# Altium project HT32.PrjPcb
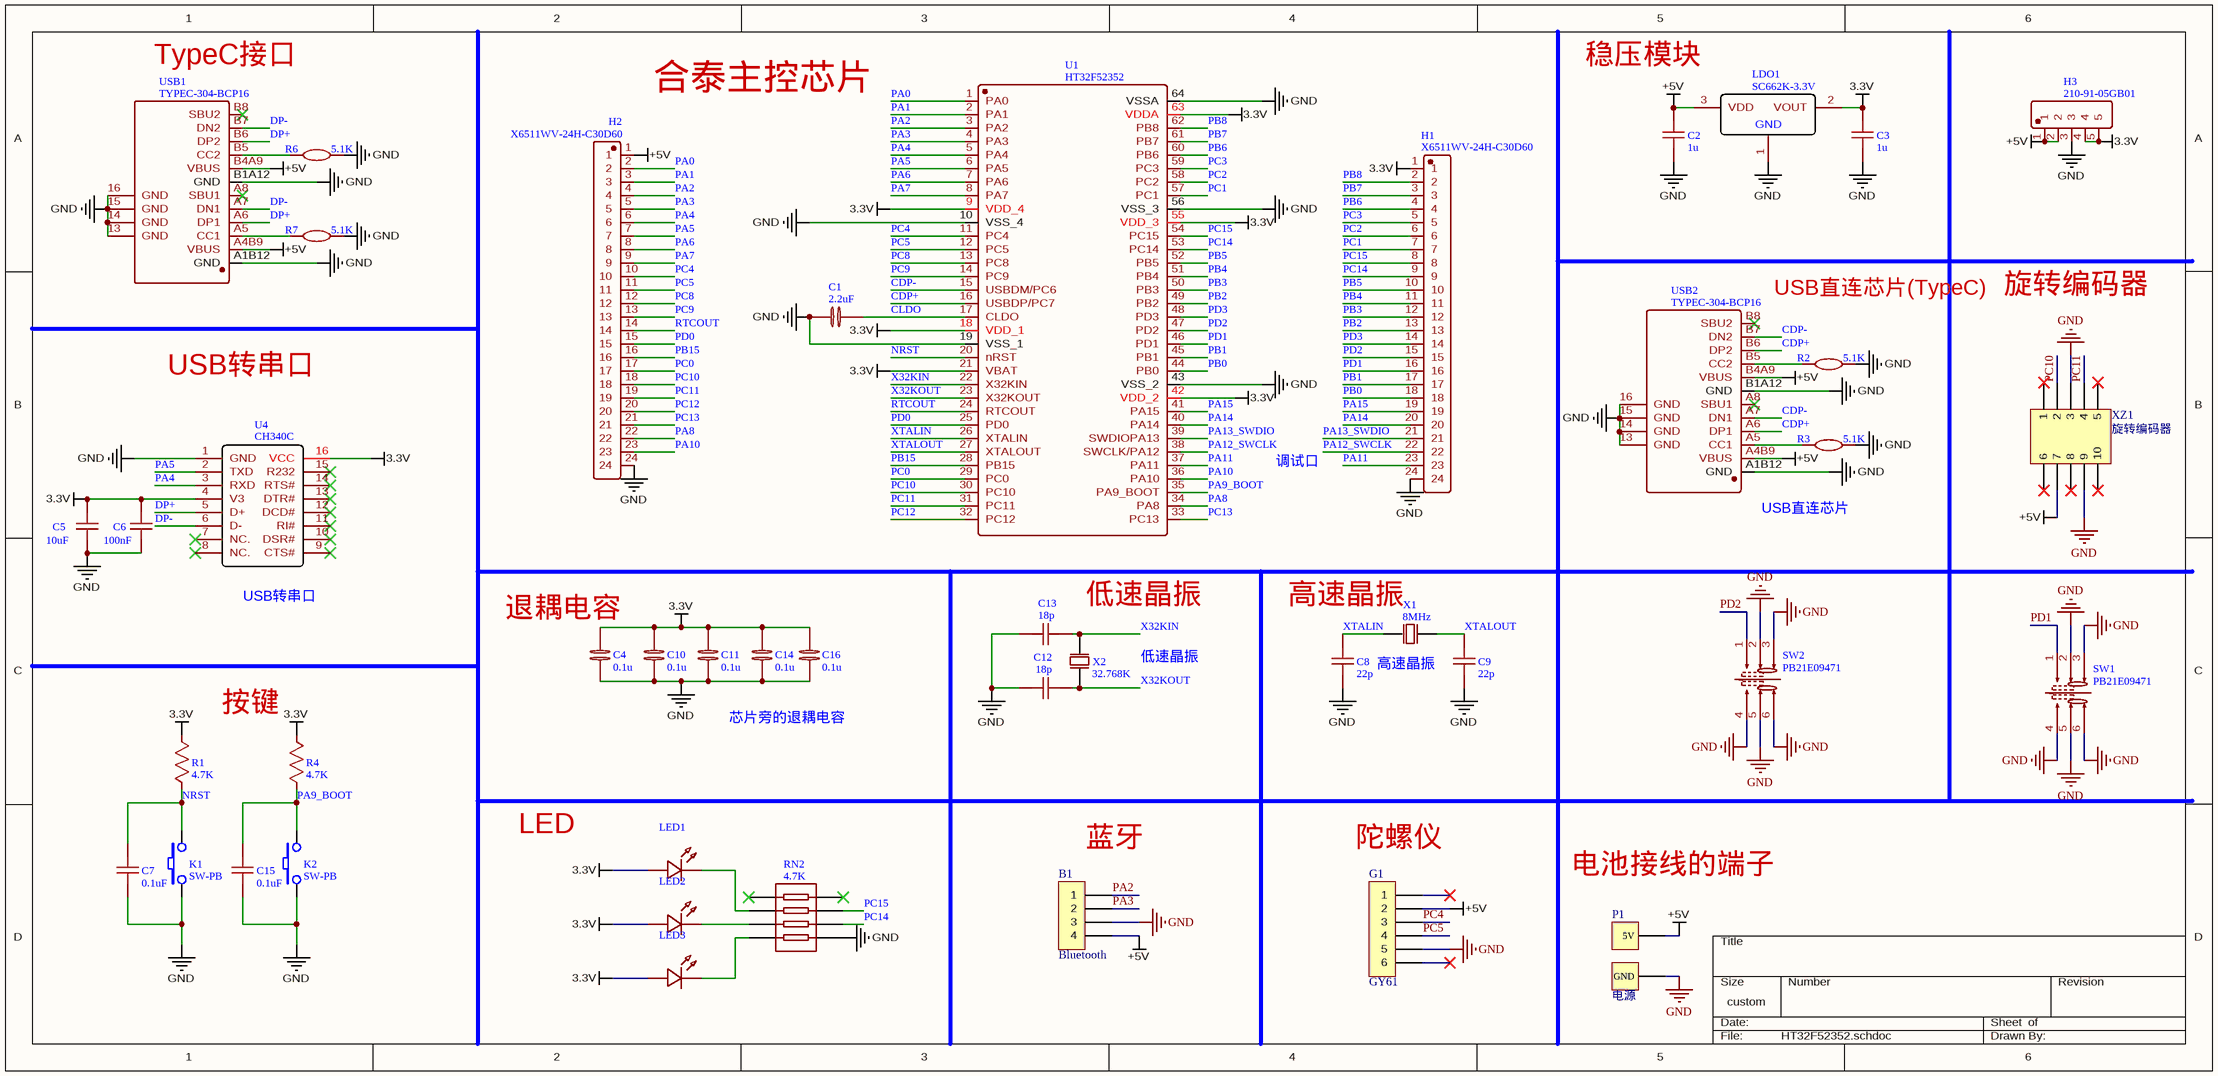
[diagram p0: HT32F52352.schdoc]
1 sheet, 44 parts. Net scope: global (net labels, ports and power ports of the same name join across sheets).
Board file: HT32.PcbDoc

## Sheet HT32F52352.schdoc
size 415 x 200 mm

### Parts
B1  Bluetooth  [HDR1X4]
C1  2.2uF  [0805_C]
C2  1u  [0805_C]
C3  1u  [0805_C]
C4  0.1u  [0805_C]
C5  10uF  [0805_C]
C6  100nF  [0805_C]
C7  0.1uF  [0805_C]
C8  22p  [0805_C]
C9  22p  [0805_C]
C10  0.1u  [0805_C]
C11  0.1u  [0805_C]
C12  18p  [0805_C]
C13  18p  [0805_C]
C14  0.1u  [0805_C]
C15  0.1uF  [0805_C]
C16  0.1u  [0805_C]
G1  GY61  [HDR1X6]
H1  X6511WV-24H-C30D60  [HDR-TH_24P-P2.54-V-M]
H2  X6511WV-24H-C30D60  [HDR-TH_24P-P2.54-V-M]
H3  210-91-05GB01  [HDR-TH_5P-P2.54-V-M]
K1  SW-PB  [SW-SMD_L6.1-W3.7-LS7.9]
K2  SW-PB  [SW-SMD_L6.1-W3.7-LS7.9]
LDO1  SC662K-3.3V  [SOT-23-3_L2.9-W1.3-P1.90-LS2.4-BR]
LED1  LED-0603_B  [LED0603_BLUE]  (value not drawn)
LED2  LED-0603_B  [LED0603_BLUE]  (value not drawn)
LED3  LED-0603_B  [LED0603_BLUE]  (value not drawn)
P1  电源  [PCBComponent_1 - duplicate]
R1  4.7K  [0805_R]
R2  5.1K  [0805_R]
R3  5.1K  [0805_R]
R4  4.7K  [0805_R]
R6  5.1K  [0805_R]
R7  5.1K  [0805_R]
RN2  4.7K  [RES-ARRAY-SMD_0603-8P-L3.2-W1.6-BL]
SW1  PB21E09471  [SW-TH_6P-L8.5-W8.5-P2.50-LS5.5-BL]
SW2  PB21E09471  [SW-TH_6P-L8.5-W8.5-P2.50-LS5.5-BL]
U1  HT32F52352  [LQFP-64_L7.0-W7.0-P0.40-LS9.2-BL]
U4  CH340C  [SOP-16_L10.0-W3.9-P1.27-LS6.0-BL]
USB1  TYPEC-304-BCP16  [USB-C-SMD_TYPEC-304-BCP16]
USB2  TYPEC-304-BCP16  [USB-C-SMD_TYPEC-304-BCP16]
X1  8MHz  [HC-49S_L11.4-W4.8]
X2  32.768K  [OSC-TH_BD3.1-P0.8-D0.3]
XZ1  旋转编码器  [rotary encoder]

### Nets
3.3V: C3.2 C4.2 C5.2 C6.1 C10.2 C11.2 C14.2 C16.2 H1.1 H3.4 H3.5 LDO1.2(VOUT) LED1.1 LED2.1 LED3.1 R1.2 R4.2 U1.9(VDD_4) U1.18(VDD_1) U1.21(VBAT) U1.42(VDD_2) U1.55(VDD_3) U1.63(VDDA) U4.4(V3) U4.16(VCC)
+5V: B1.4 C2.2 G1.2 H2.1 H3.1 H3.2 LDO1.3(VDD) P1.1(5V) USB1.A4B9(VBUS) USB1.B4A9(VBUS) USB2.A4B9(VBUS) USB2.B4A9(VBUS) XZ1.7
GND: B1.3 C1.1 C2.1 C3.1 C4.1 C5.1 C6.2 C7.1 C8.1 C9.1 C10.1 C11.1 C12.2 C13.1 C14.1 C15.1 C16.1 G1.5 H1.24 H2.24 H3.3 K1.2 K2.2 LDO1.1(GND) P1.2(GND) R2.1 R3.1 R6.1 R7.1 RN2.5 SW1.2 SW1.3 SW1.4 SW1.5 SW1.6 SW2.2 SW2.3 SW2.4 SW2.5 SW2.6 U1.10(VSS_4) U1.19(VSS_1) U1.43(VSS_2) U1.56(VSS_3) U1.64(VSSA) U4.1(GND) USB1.13(GND) USB1.14(GND) USB1.15(GND) USB1.16(GND) USB1.A1B12(GND) USB1.B1A12(GND) USB2.13(GND) USB2.14(GND) USB2.15(GND) USB2.16(GND) USB2.A1B12(GND) USB2.B1A12(GND) XZ1.3 XZ1.9
CDP+: U1.16(USBDP/PC7) USB2.A6(DP1) USB2.B6(DP2)
CDP-: U1.15(USBDM/PC6) USB2.A7(DN1) USB2.B7(DN2)
CLDO: C1.2 U1.17(CLDO)
DP+: U4.5(D+) USB1.A6(DP1) USB1.B6(DP2)
DP-: U4.6(D-) USB1.A7(DN1) USB1.B7(DN2)
NRST: C7.2 K1.1 R1.1 U1.20(nRST)
PA0: H2.2 U1.1(PA0)
PA1: H2.3 U1.2(PA1)
PA2: B1.1 H2.4 U1.3(PA2)
PA3: B1.2 H2.5 U1.4(PA3)
PA4: H2.6 U1.5(PA4) U4.3(RXD)
PA5: H2.7 U1.6(PA5) U4.2(TXD)
PA6: H2.8 U1.7(PA6)
PA7: H2.9 U1.8(PA7)
PA8: H2.22 U1.34(PA8)
PA9_BOOT: C15.2 K2.1 R4.1 U1.35(PA9_BOOT)
PA10: H2.23 U1.36(PA10)
PA11: H1.23 U1.37(PA11)
PA12_SWCLK: H1.22 U1.38(SWCLK/PA12)
PA13_SWDIO: H1.21 U1.39(SWDIOPA13)
PA14: H1.20 U1.40(PA14)
PA15: H1.19 U1.41(PA15)
PB0: H1.18 U1.44(PB0)
PB1: H1.17 U1.45(PB1)
PB2: H1.13 U1.49(PB2)
PB3: H1.12 U1.50(PB3)
PB4: H1.11 U1.51(PB4)
PB5: H1.10 U1.52(PB5)
PB6: H1.4 U1.60(PB6)
PB7: H1.3 U1.61(PB7)
PB8: H1.2 U1.62(PB8)
PB15: H2.16 U1.28(PB15)
PC0: H2.17 U1.29(PC0)
PC1: H1.7 U1.57(PC1)
PC2: H1.6 U1.58(PC2)
PC3: H1.5 U1.59(PC3)
PC4: G1.3 H2.10 U1.11(PC4)
PC5: G1.4 H2.11 U1.12(PC5)
PC8: H2.12 U1.13(PC8)
PC9: H2.13 U1.14(PC9)
PC10: H2.18 U1.30(PC10) XZ1.2
PC11: H2.19 U1.31(PC11) XZ1.4
PC12: H2.20 U1.32(PC12)
PC13: H2.21 U1.33(PC13)
PC14: H1.9 RN2.6 U1.53(PC14)
PC15: H1.8 RN2.7 U1.54(PC15)
PD0: H2.15 U1.25(PD0)
PD1: H1.16 SW1.1 U1.46(PD1)
PD2: H1.15 SW2.1 U1.47(PD2)
PD3: H1.14 U1.48(PD3)
RTCOUT: H2.14 U1.24(RTCOUT)
X32KIN: C13.2 U1.22(X32KIN) X2.1(OSC1)
X32KOUT: C12.1 U1.23(X32KOUT) X2.2(OSC2)
XTALIN: C8.2 U1.26(XTALIN) X1.1(OSC1)
XTALOUT: C9.2 U1.27(XTALOUT) X1.2(OSC2)
NetLED1_2: LED1.2 RN2.2
NetLED2_2: LED2.2 RN2.3
NetLED3_2: LED3.2 RN2.4
NetR2_2: R2.2 USB2.B5(CC2)
NetR3_2: R3.2 USB2.A5(CC1)
NetR6_2: R6.2 USB1.B5(CC2)
NetR7_2: R7.2 USB1.A5(CC1)

Not connected (* = marked no-connect by the designer): G1 1* 6*; RN2 1* 8*; U4 7(NC.)* 8(NC.)* 9(CTS#)* 10(DSR#)* 11(RI#)* 12(DCD#)* 13(DTR#)* 14(RTS#)* 15(R232)*; USB1 A8(SBU1)* B8(SBU2)*; USB2 A8(SBU1)* B8(SBU2)*; XZ1 1* 5* 6* 8* 10*

### Notes on the sheet
- (near USB1) TypeC接口
- 稳压模块
- 合泰主控芯片
- USB直连芯片(TypeC)
- 旋转编码器
- USB转串口
- 调试口
- USB直连芯片
- (near U4) USB转串口
- (near C4) 退耦电容
- 低速晶振
- 高速晶振
- 按键
- 芯片旁的退耦电容
- LED
- (near B1) 蓝牙
- (near G1) 陀螺仪
- 电池接线的端子

### Library data of the parts
C1 = 2.2uF: nameAlias: Value(F); Contributor: LCEDA_Lib; spicePre: C; spiceSymbolName: C_0603_EU
C2 C3 = 1u: nameAlias: Value(F); Contributor: LCEDA_Lib; spicePre: C; spiceSymbolName: C_0603_US
C4 C10 C11 C14 C16 = 0.1u: nameAlias: Value(F); Contributor: LCEDA_Lib; spicePre: C; spiceSymbolName: C_0603_EU
C5 = 10uF: nameAlias: Value(F); spicePre: C; spiceSymbolName: Cap_RAD-0.1_US
C6 = 100nF: nameAlias: Value(F); spicePre: C; spiceSymbolName: Cap_RAD-0.1_US
C7 C15 = 0.1uF: nameAlias: Value(F); spicePre: C; spiceSymbolName: Cap_RAD-0.1_US
C8 C9 = 22p: nameAlias: Value(F); Contributor: LCEDA_Lib; spicePre: C; spiceSymbolName: C_0603_US
C12 C13 = 18p: nameAlias: Value(F); Contributor: LCEDA_Lib; spicePre: C; spiceSymbolName: C_0603_US
H1 H2 = X6511WV-24H-C30D60: BOM_Manufacturer: XKB Connectivity; Contributor: LCSC; BOM_Supplier: LCSC; BOM_Supplier Part: C725956; BOM_Manufacturer Part: X6511WV-24H-C30D60; BOM_JLCPCB Part Class: Extended Part; spicePre: H; spiceSymbolName: X6511WV-24H-C30D60
H3 = 210-91-05GB01: BOM_Manufacturer: PINREX; Contributor: LCSC; BOM_Supplier: LCSC; BOM_Supplier Part: C390682; BOM_Manufacturer Part: 210-91-05GB01; BOM_JLCPCB Part Class: Extended Part; spicePre: H; spiceSymbolName: 210-91-05GB01
K1 K2 = SW-PB: Contributor: ZhangYonghui; spicePre: K; spiceSymbolName: SW-PB
LDO1 = SC662K-3.3V: BOM_Manufacturer: FM; BOM_Supplier: LCSC; BOM_Manufacturer Part: SC662K-3.3V; BOM_Supplier Part: C83932; BOM_JLCPCB Part Class: Extended Part; spicePre: L; spiceSymbolName: SC662K-3.3V
LED1-LED3 = LED-0603_B: BOM_Manufacturer: EVERLIGHT(台湾亿光); BOM_Manufacturer Part: 19-217/BHC-ZL1M2RY/3T; Contributor: LCEDA_01; BOM_Supplier Part: C72041; BOM_Supplier: LCSC; spicePre: L; spiceSymbolName: LED-0603_B
R1 R4 = 4.7K: nameAlias: Value(Ω); Contributor: LCEDA_Lib; spicePre: R; spiceSymbolName: R_0603_US
R2 R3 R6 R7 = 5.1K: nameAlias: Value(Ω); spicePre: R; spiceSymbolName: Resistor; BOM_Supplier: LCSC
RN2 = 4.7K: BOM_Manufacturer: PANASONIC; BOM_Manufacturer Part: EXB-38V472JV; nameAlias: Resistance (Ohms); Contributor: LCSC; BOM_Supplier: LCSC; BOM_Supplier Part: C194232; BOM_JLCPCB Part Class: Extended Part; spicePre: R; spiceSymbolName: EXB-38V472JV
SW1 SW2 = PB21E09471: BOM_Manufacturer: GANGYUAN; Contributor: LCSC; BOM_Supplier: LCSC; BOM_Supplier Part: C194403; BOM_Manufacturer Part: PB21E09471; BOM_JLCPCB Part Class: Extended Part; spicePre: S; spiceSymbolName: PB21E09471
U1 = HT32F52352: BOM_Manufacturer: HOLTEK; BOM_Supplier: LCSC; BOM_Manufacturer Part: HT32F52352; BOM_Supplier Part: C97188; BOM_JLCPCB Part Class: Extended Part; spicePre: U; spiceSymbolName: HT32F52352
U4 = CH340C: BOM_Manufacturer: WCH; BOM_Supplier: LCSC; BOM_Manufacturer Part: CH340C; BOM_Supplier Part: C84681; BOM_JLCPCB Part Class: Extended Part; spicePre: U; spiceSymbolName: CH340C
USB1 USB2 = TYPEC-304-BCP16: BOM_Manufacturer: XUNPU; Contributor: LCSC; BOM_Supplier: LCSC; BOM_Supplier Part: C720629; BOM_Manufacturer Part: TYPEC-304-BCP16; BOM_JLCPCB Part Class: Extended Part; spicePre: U; spiceSymbolName: TYPEC-304-BCP16
X1 = 8MHz: BOM_Manufacturer: Zhejiang Abel Elec; BOM_Manufacturer Part: HC-49SM8MHz20pF30ppm; nameAlias: Frequency; Contributor: LCSC; BOM_Supplier: LCSC; BOM_Supplier Part: C107426; BOM_JLCPCB Part Class: Extended Part; spicePre: X; spiceSymbolName: HC-49SM8MHZ20PF30PPM
X2 = 32.768K: BOM_Manufacturer: KDS Daishinku; BOM_Manufacturer Part: 1TC125DFNS019; nameAlias: Value; Contributor: LCSC; BOM_Supplier: LCSC; BOM_Supplier Part: C213421; BOM_JLCPCB Part Class: Extended Part; spicePre: X; spiceSymbolName: 1TC125DFNS019